# EAGLE design VoltageSourcePCB (EAGLE 9.4.2)
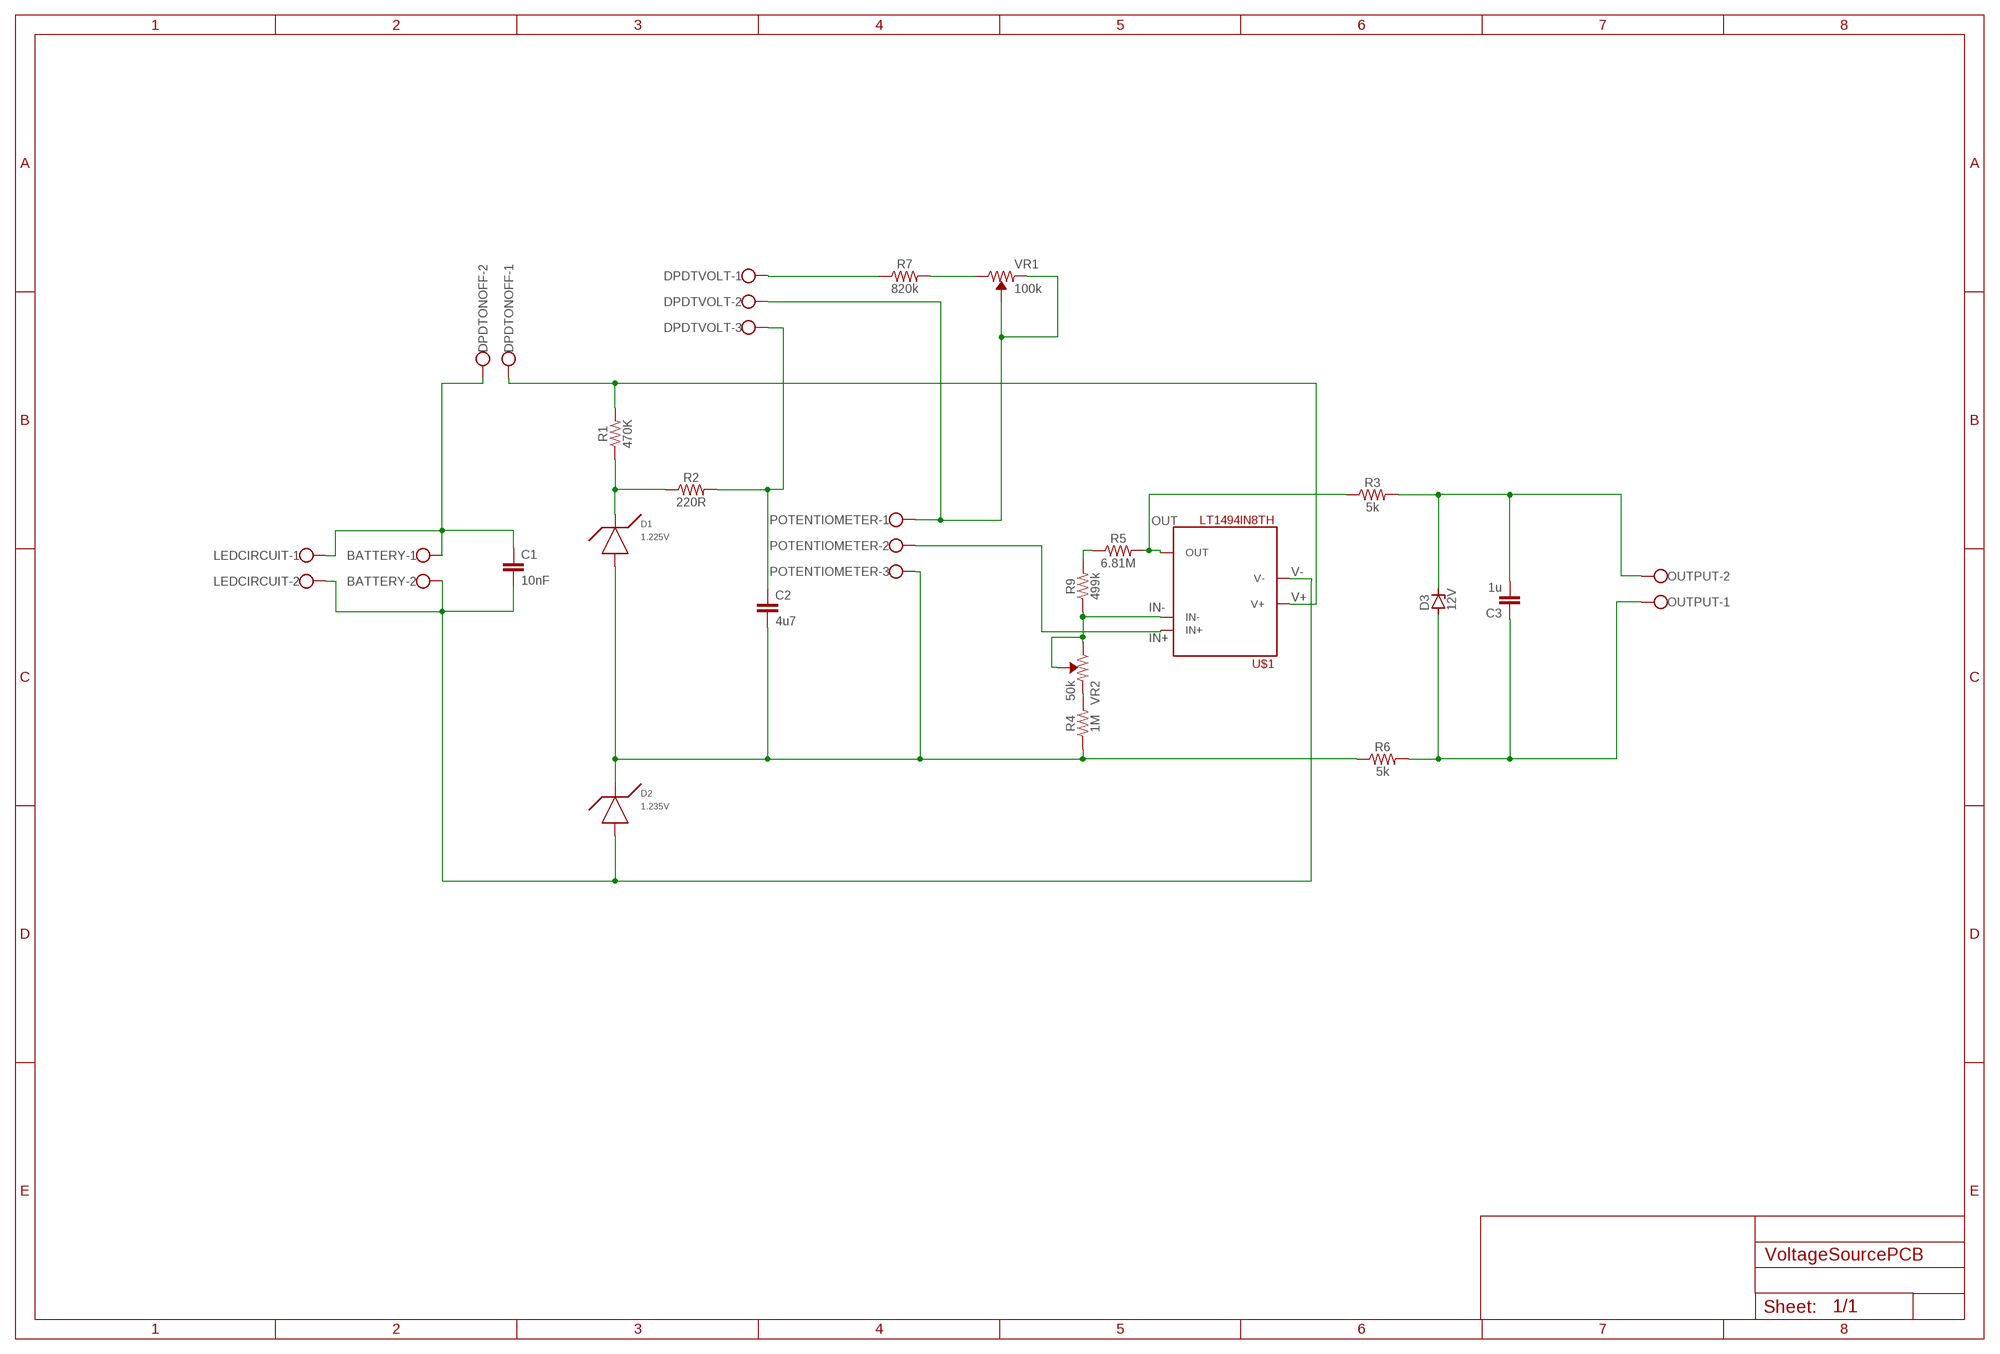
[diagram p0: schematic, sheet 1]

## Parts
BATTERY  W237-102  [W237-102]
C1  10nF  C5/2.5  [C5B2.5]
C2  4u7  C22/11  [C22.5B11]
C3  1u  C-EU150-072X183  [C150-072X183]
D1  1.225V  LT1004CZ1.225V  [LT1004CZ]
D2  1.235V  LT1004CZ1.235V  [LT1004CZ]
D3  12V  ZENER-DIODEC1702-15  [C1702-15]
DPDTONOFF  W237-102  [W237-102]
DPDTVOLT  W237-103  [W237-103]
LEDCIRCUIT  W237-102  [W237-102]
OUTPUT  W237-102  [W237-102]
POTENTIOMETER  W237-103  [W237-103]
R1  470K  RESISTOR0805  [0805]
R2  220R  RESISTOR0805  [0805]
R3  5k  RESISTOR0805  [0805]
R4  1M  RESISTOR0805  [0805]
R5  6.81M  RESISTOR0805  [0805]
R6  5k  RESISTOR0805  [0805]
R7  820k  RESISTOR0805  [0805]
R9  499k  RESISTOR0805  [0805]
U$1  LT1494IN8TH  [LT1494TH]
VR1  100k  TRIMPOT-SMD-3MM-OPEN-1/10W-25%  [TRIMPOT-SMD-TC33X]
VR2  50k  TRIMPOT-SMD-3MM-OPEN-1/10W-25%  [TRIMPOT-SMD-TC33X]

## Nets
IN+: POTENTIOMETER.2 U$1.3(IN+)
IN-: R9.1 U$1.2(IN-) VR2.1(CW) VR2.2(WIPER)
N$6: D1.CATHODE R1.1 R2.1
N$7: C2.2 D1.ANODE D2.CATHODE POTENTIOMETER.3 R4.1 R6.1
N$8: C2.1 DPDTVOLT.3 R2.2
N$11: DPDTVOLT.2 POTENTIOMETER.1 VR1.2(WIPER) VR1.3(CCW)
N$12: DPDTVOLT.1 R7.1
N$14: BATTERY.1 C1.1 DPDTONOFF.2 LEDCIRCUIT.1
N$16: C3.2 D3.C OUTPUT.2 R3.2
N$17: C3.1 D3.A OUTPUT.1 R6.2
N$18: R4.2 VR2.3(CCW)
N$19: R7.2 VR1.1(CW)
N$20: R5.1 R9.2
OUT: R3.1 R5.2 U$1.6(OUT)
V+: DPDTONOFF.1 R1.2 U$1.7(V+)
V-: BATTERY.2 C1.2 D2.ANODE LEDCIRCUIT.2 U$1.4(V-)

## Library data of the parts
BATTERY DPDTONOFF LEDCIRCUIT OUTPUT = con-wago-500:W237-102: WAGO SCREW CLAMP; MPN: 237-102; OC_FARNELL: unknown; OC_NEWARK: 70K9898
C1 C2 = capacitor-wima:C: CAPACITOR naming: grid - package width
C3 = rcl:C-EU: CAPACITOR, European symbol; SPICEPREFIX: C
D1 D2 = RequiredComponents:LT1004CZ: Description: This is a LT1004CZ zener diode that is contained in a 3 pin holder. This can be used as a micropower voltage reference
D3 = diode:ZENER-DIODE: Z-Diode
DPDTVOLT POTENTIOMETER = con-wago-500:W237-103: WAGO SCREW CLAMP; MPN: 237-103; OC_FARNELL: unknown; OC_NEWARK: 18M7116
R1-R7 R9 = SparkFun-Resistors:RESISTOR: Generic Resistor Package
U$1 = RequiredComponents:LT1494IN8
VR1 VR2 = SparkFun-Resistors:TRIMPOT: Trimming Potentiometer (Trimpot) Three-terminal potentiometers, with an adjustable wiper and two adjustable resistors. A pot can be used to create a configurable voltage divider, or as a variable resistor. "Trimpots" are a subset of potentiometers, usually intended for "set-and-forget" applications. They're often more delicate than standard potentiometers - rated for fewer turns. Variants PTH-KNOB - PTH Trimpot w/ finger-adjustable knob Trimpot 10K with Knob <https://www.sparkfun.com/products/9806> (COM-09806) Datasheet <http://www.sparkfun.com/datasheets/Components/General/TSR-3386.pdf> SMD-3MM-CLOSED-FRAME - SMD 3mm Square Closed-Frame Trimpot Used on e.g. EasyDriver - Stepper Motor Driver <https://www.sparkfun.com/products/12779> Datasheet <http://www.bitechnologies.com/pdfs/22.pdf> (22AR10KTR) SMD-5MM - SMD 5mm Square Closed-Frame Trimpot Used on e.g. IOIO-OTG - V2.2 <https://www.sparkfun.com/products/13613> Datasheet <http://www.vishay.com/docs/51008/ts53.pdf> (TS53YL502MR10) SMD-3MM-1/10W-25% - 3mm Square Open-Frame Trimpot Used on e.g. SparkFun Shapeoko <https://www.sparkfun.com/products/13899> Datasheet <http://www.bourns.com/docs/Product-Datasheets/TC33.pdf> (TC33X-2-103E); PROD_ID: RES-12428, RES-08048; VALUE: 10k

## Board
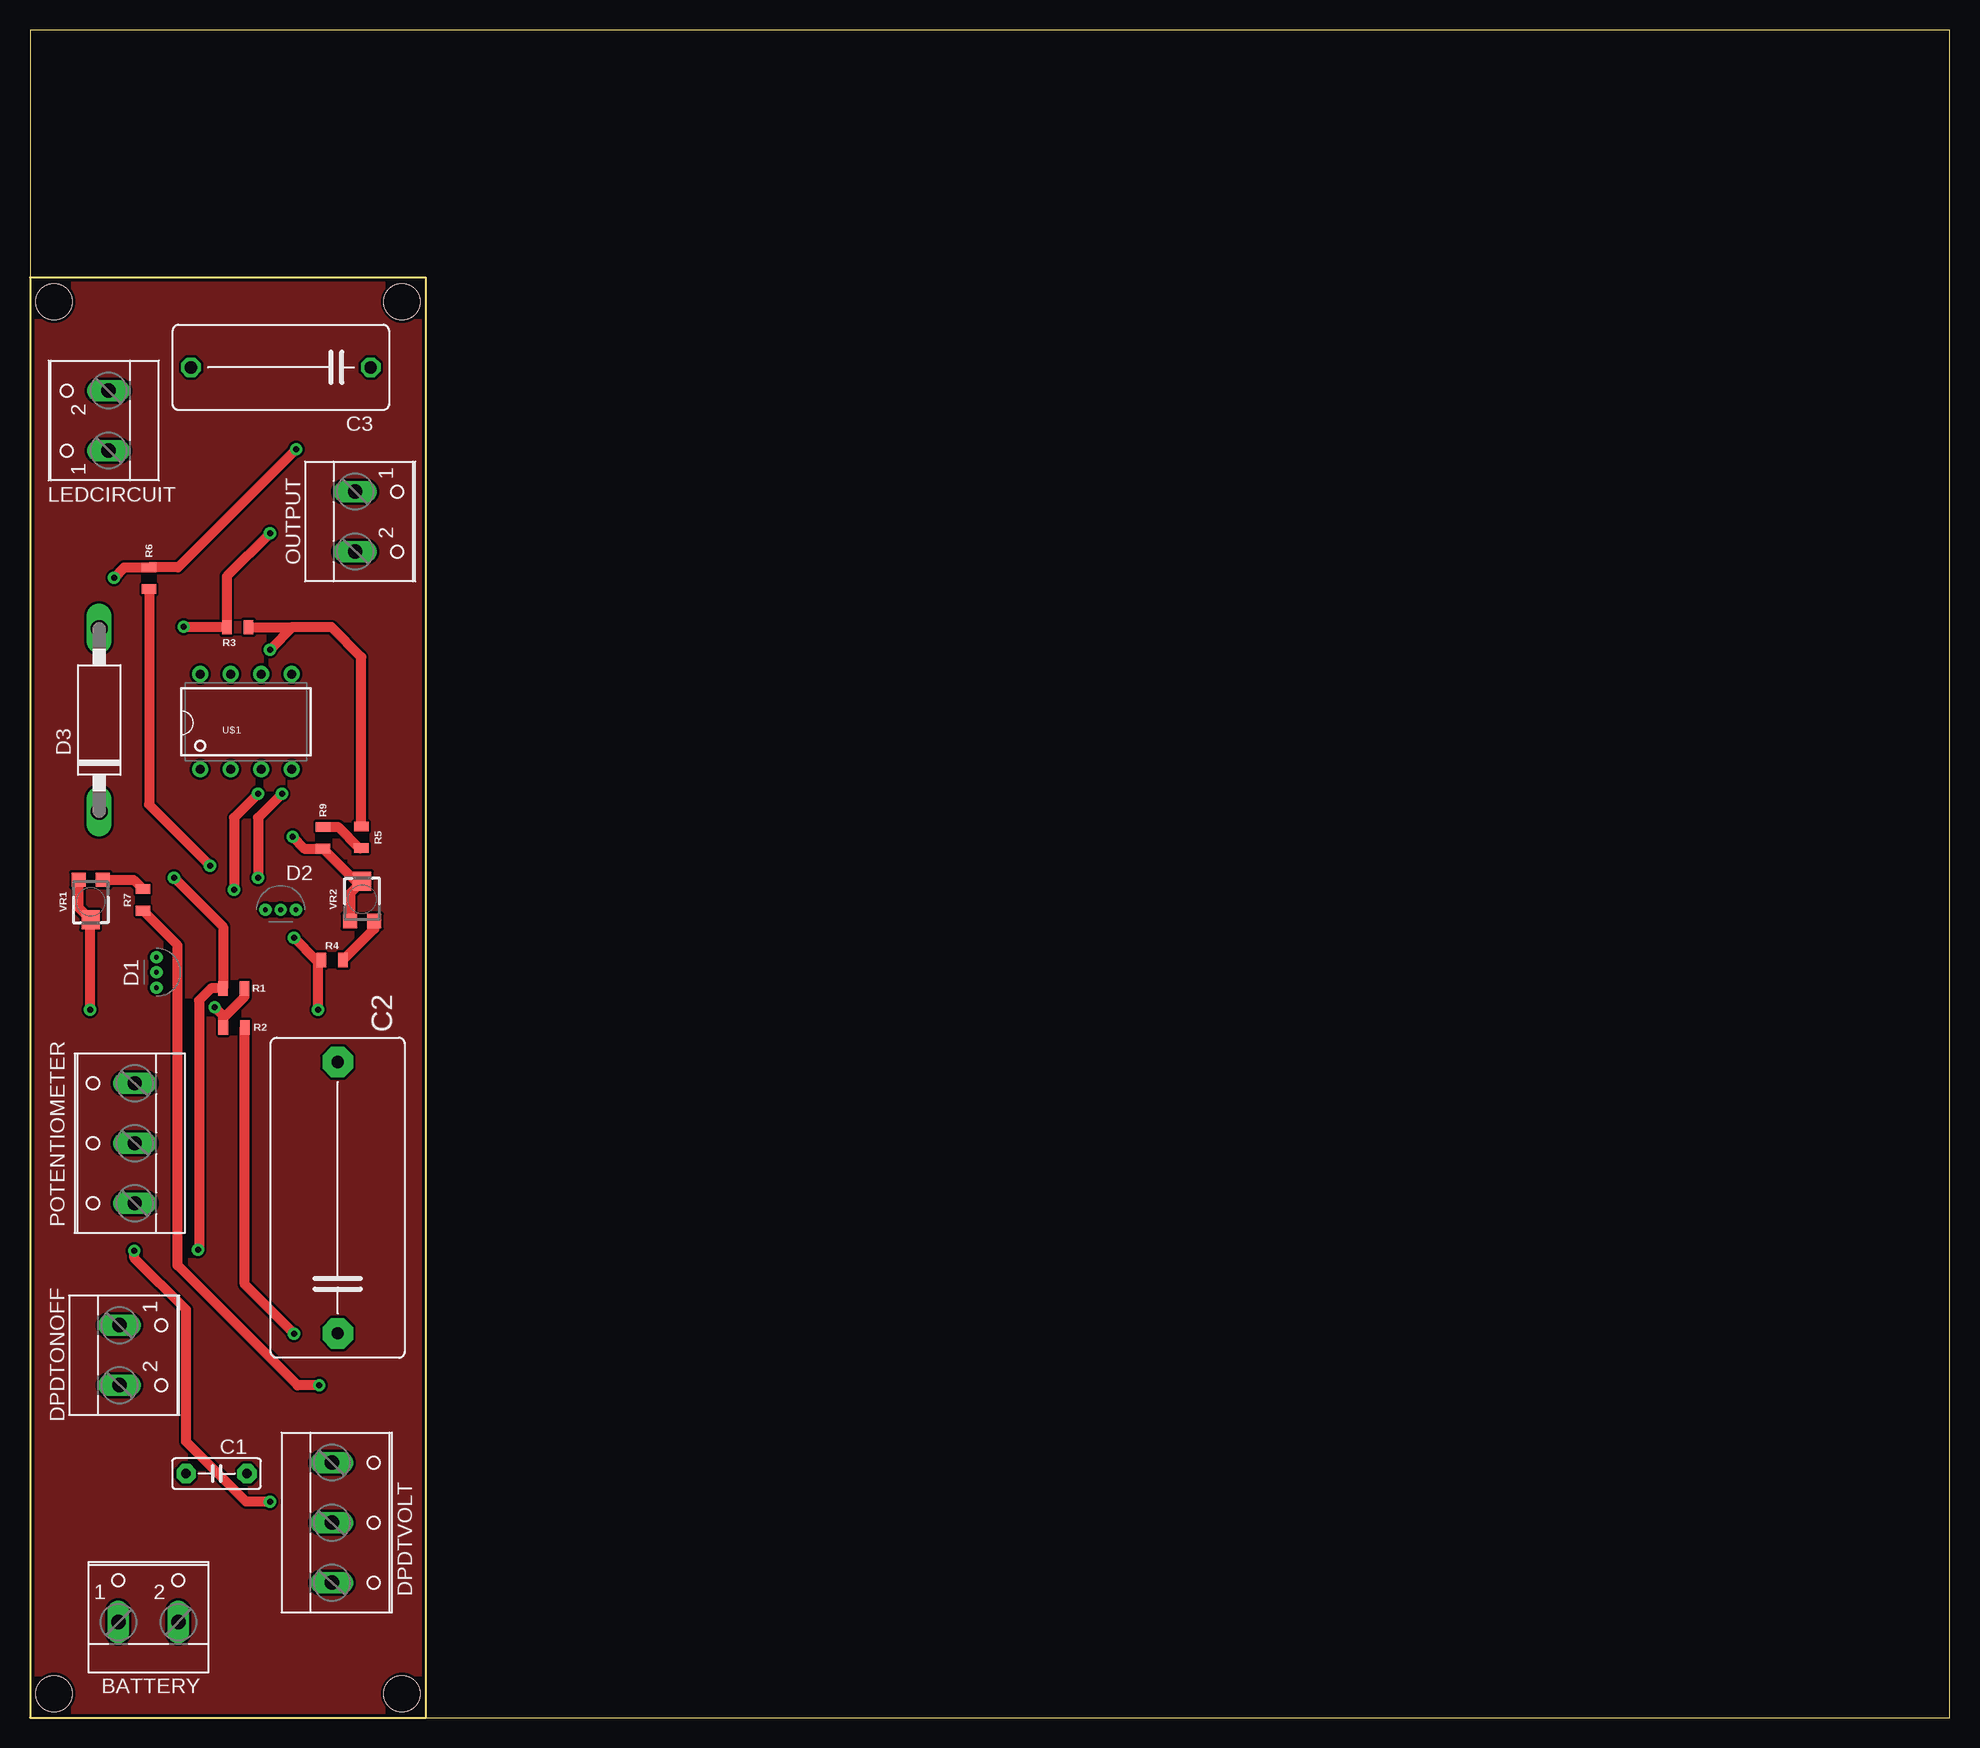
[diagram p1: board, top side]
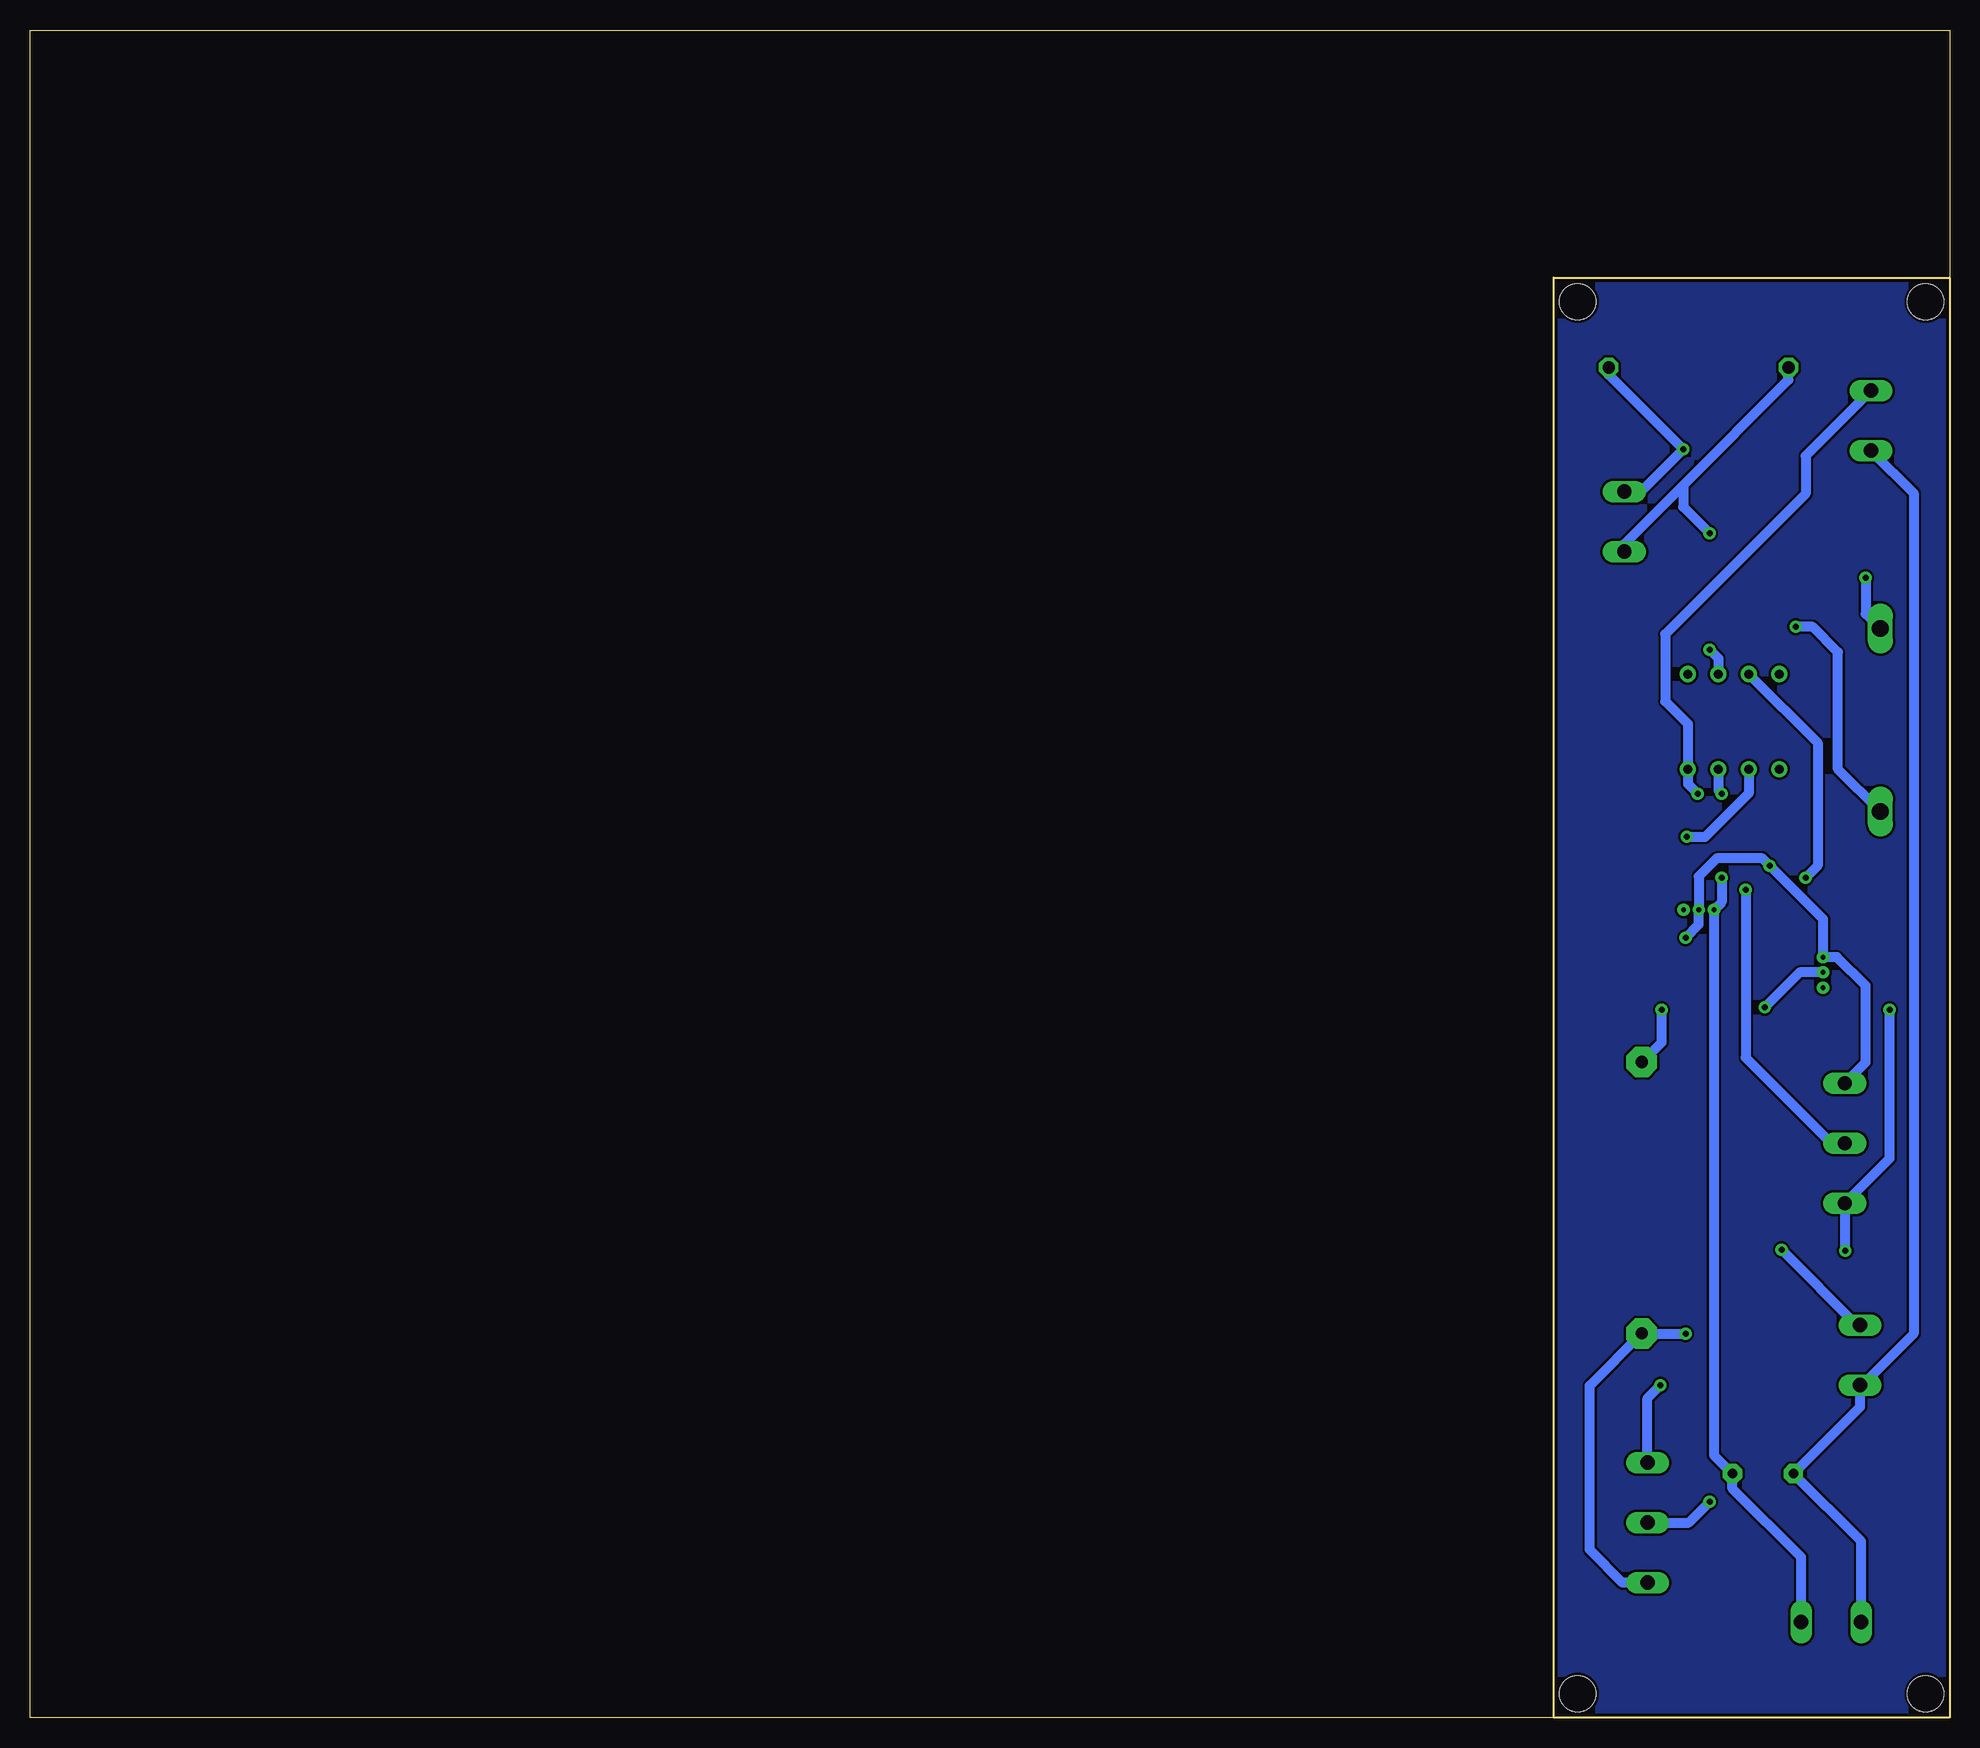
[diagram p2: board, bottom side, seen from below]

Size 160 x 140.64 mm. Coordinates in mm from the lower left corner, seen from the top.
Outline: 33,0 160,0 160,140.64 0,140.64 0,120
Outline: 33,0 33,120 0,120
Outline: 0,120 0,0 33,0
Copper layers (1*16): Top 0.035mm / dielectric 1.5mm / Bottom 0.035mm
Design rules "PCBTrain": minimum track width 8mil, minimum drill 0.2mm, track to track 8mil, track to pad 8mil, pad to pad 8mil, via to via 8mil, smd to smd 8mil, copper to edge 0.25mm, drill to drill 8mil, minimum pad ring 12mil, minimum via ring 10mil, stop-mask expansion 4mil, vias tented up to drill 20mil, thermal gap 10mil
Holes 3 mm at 2,2 31,2 2,118 31,118

### Footprints (pad centres in the part's own frame; a part is rotated, then mirrored left to right if it is on the bottom)
W237-102 = drill 1.194 long: 1 -2.5,-1.27; 2 2.5,-1.27
C5B2.5 = drill 0.813 pad 1.6 octagon: 1 -2.54,0; 2 2.54,0
C22.5B11 = drill 1.016 pad 2.54 octagon: 1 -11.303,0; 2 11.303,0
C150-072X183 = drill 1.016 octagon: 1 -7.493,0; 2 7.493,0
LT1004CZ = drill 0.406: ANODE -1.27,0; CATHODE 0,0; NC 1.27,0
C1702-15 = drill 1.397 long: A 7.62,0; C -7.62,0
W237-103 = drill 1.194 long: 1 -5,-1.29; 2 0,-1.29; 3 5,-1.29
0805 = smd 0.8 x 1.2: 1 -0.9,0; 2 0.9,0
LT1494TH = drill 0.75: 1 -3.81,-3.969; 2 -1.27,-3.969; 3 1.27,-3.969; 4 3.81,-3.969; 5 3.81,3.969; 6 1.27,3.969; 7 -1.27,3.969; 8 -3.81,3.969
TRIMPOT-SMD-TC33X = smd 1.2 x 1.2: 1 -1,-1.825; 3 1,-1.825 | smd 1.5 x 1.6: 2 0,1.5

### Placement (x,y rotation side)
BATTERY  9.87,9.23 0 top
C1  15.55,20.34 0 top
C2  25.65,43.33 90 top
C3  20.91,112.52 180 top
D1  10.54,62.11 270 top
D2  20.9,67.34 0 top
D3  5.77,83.14 90 top
DPDTONOFF  8.72,30.21 270 top
DPDTVOLT  26.46,16.26 270 top
LEDCIRCUIT  5.28,108.09 90 top
OUTPUT  28.38,99.68 270 top
POTENTIOMETER  7.44,47.87 90 top
R1  16.99,60.77 180 top
R2  17,57.53 0 top
R3  17.31,90.87 180 top
R4  25.18,63.13 0 top
R5  27.62,73.36 90 top
R6  9.92,94.95 90 top
R7  9.42,68.14 90 top
R9  24.42,73.33 90 top
U$1  18,83 0 top
VR1  5.06,68 180 top
VR2  27.69,68.2 0 top

### Tracks (layer width: path | path; a pad name or v marks a point on that pad's centre or on a via)
IN+  (via drill 0.5)
  Top 0.813: v19,77 17,75 v17,69
  Bottom 0.813: U$1.3 19.27,77.27 v19,77 | v17,69 17,55 9.87,47.87 POTENTIOMETER.2
IN-  (via drill 0.5)
  Top 0.813: VR2.1 26.69,68.7 VR2.2 27.15,69.7 R9.1 22.87,72.43 v21.9,73.4
  Bottom 0.813: U$1.2 16.73,77.03 20.36,73.4 v21.9,73.4
N$6  (via drill 0.5)
  Top 0.813: R2.1 16.1,58.3 | R1.1 17.89,60.09 16.1,58.3 | v15.4,59.2 16.1,58.5 16.1,58.3
  Bottom 0.813: D1.CATHODE 12.49,62.11 v15.4,59.2
N$7  (via drill 0.5)
  Top 0.813: v22,65 23.87,63.13 R4.1 24,62.85 v24,59 | R6.1 9.92,76.08 v15,71
  Bottom 0.813: v22,65 20.9,66.1 D2.CATHODE 20.9,70.1 19.4,71.6 15.6,71.6 v15,71 10.54,66.54 D1.ANODE 9.38,63.38 7,61 7,54.6 POTENTIOMETER.3 | C2.2 24,56.28 v24,59
N$8  (via drill 0.5)
  Top 0.813: v22,32 17.9,36.1 R2.2
  Bottom 0.813: DPDTVOLT.3 27.26,11.26 30,14 30,27.68 C2.1 25.62,32 v22,32
N$11  (via drill 0.5)
  Top 0.813: v20,18 18,18 13,23 13,34 8.7,38.3 v8.7,38.9 | v5,59 5,66.44 VR1.2 4.06,67.5 VR1.3
  Bottom 0.813: DPDTVOLT.2 21.74,16.26 v20,18 | v8.7,38.9 8.7,42.84 POTENTIOMETER.1 5,46.6 v5,59
N$12  (via drill 0.5)
  Top 0.813: v24.1,27.7 22.3,27.7 12.3,37.7 12.3,64.36 R7.1
  Bottom 0.813: DPDTVOLT.1 25.17,26.63 v24.1,27.7
N$14
  Bottom 0.813: BATTERY.1 7.37,14.7 C1.1 7.45,25.9 DPDTONOFF.2 7.29,27.71 3,32 3,102.04 LEDCIRCUIT.1
N$16  (via drill 0.5)
  Top 0.813: v20,98.7 16.41,95.11 R3.2 16.38,90.9 v12.8,90.9
  Bottom 0.813: OUTPUT.2 27.11,97.79 22.2,102.7 | 22.2,102.7 22.2,100.9 v20,98.7 | D3.C 9.3,79.05 9.3,88.8 11.4,90.9 v12.8,90.9 | 22.2,102.7 13.42,111.48 C3.2
N$17  (via drill 0.5)
  Top 0.813: v7,95 7.85,95.85 R6.2 12.35,95.85 v22.2,105.7
  Bottom 0.813: v7,95 7,91.99 D3.A | OUTPUT.1 25.72,102.18 v22.2,105.7 28.4,111.9 C3.1
N$18
  Top 0.813: VR2.3 28.69,65.74 R4.2
N$19
  Top 0.813: VR1.1 8.63,69.83 R7.2
N$20
  Top 0.813: R9.2 25.67,74.23 27.44,72.46 R5.1
NOT
  pour Top (rank 2): 0,120 33,120 33,0 0,0
  pour Bottom (rank 2): 0,120 33,120 33,0 0,0
OUT  (via drill 0.5)
  Top 0.813: R5.2 27.62,88.38 25.13,90.87 21.87,90.87 | 21.87,90.87 v20,89 | R3.1 21.87,90.87
  Bottom 0.813: v20,89 19.27,88.27 U$1.6
V+  (via drill 0.5)
  Top 0.813: v12,70 16.09,65.91 R1.2 15.09,60.77 14.1,59.78 14.1,39.1 v14,39
  Bottom 0.813: v14,39 7.71,32.71 DPDTONOFF.1 | U$1.7 11,81.24 11,71 v12,70
V-  (via drill 0.5)
  Top 0.813: v21,77 19,75 v19,70
  Bottom 0.813: BATTERY.2 12.37,13.37 18.09,19.09 C1.2 19.63,21.88 D2.ANODE 19,67.97 v19,70 | v21,77 21.81,77.81 U$1.4 21.81,82.81 23.7,84.7 23.7,90.3 12,102 12,105.14 LEDCIRCUIT.2